# Altium schematic sheet Memory_SRAM.SchDoc
size A4; SheetNumber: 2; SheetTotal: 7
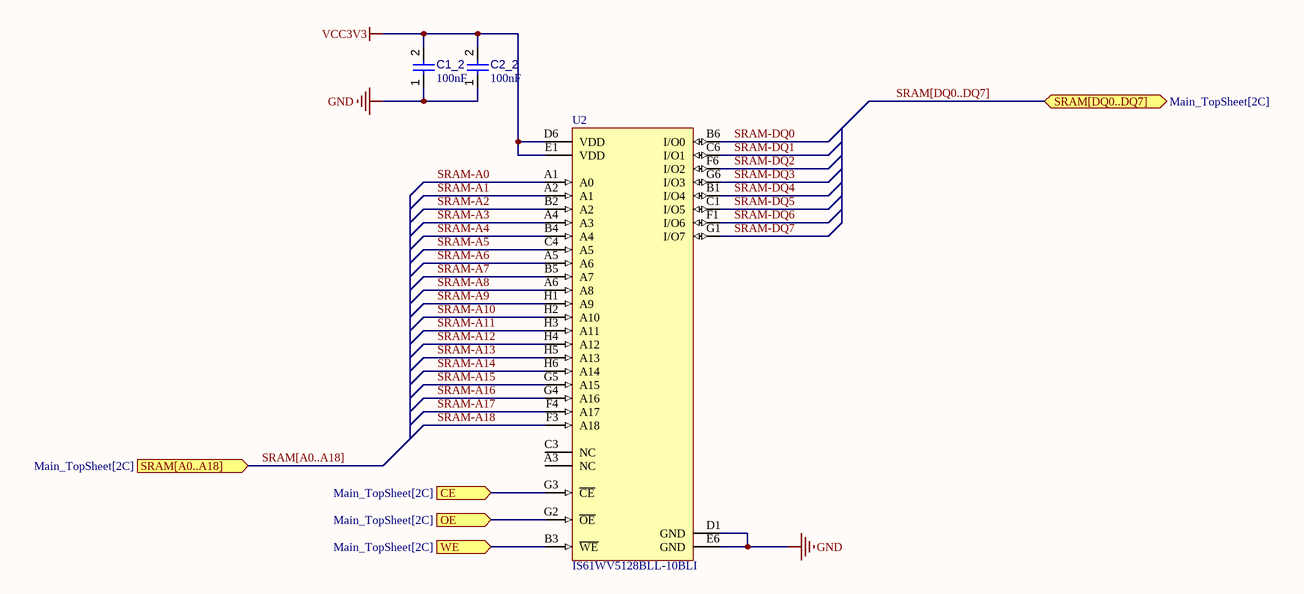
[diagram p0: Memory_SRAM.SchDoc]

## Parts
C1_2  value 100nF  [CAPC0402(1005)60_L]  (hidden comment: Capacitor 100nF +/-20% 10V 0402)
C2_2  value 100nF  [CAPC0402(1005)60_L]  (hidden comment: Capacitor 100nF +/-20% 10V 0402)
U2  IS61WV5128BLL-10BLI  [FP-IS61WV5128BLL-10BLI-IPC_A]

## Ports
CE (in, see Main_TopSheet[2C]), OE (in, see Main_TopSheet[2C]), SRAM[A0..A18] (in, see Main_TopSheet[2C]), SRAM[DQ0..DQ7] (bidir, see Main_TopSheet[2C]), WE (in, see Main_TopSheet[2C])

## Nets
GND: C1_2.1 C2_2.1 U2.D1(GND) U2.E6(GND)
VCC3V3: C1_2.2 C2_2.2 U2.D6(VDD) U2.E1(VDD)
CE: U2.G3(~{CE}) ; port CE
OE: U2.G2(~{OE}) ; port OE
SRAM-A0: U2.A1(A0)
SRAM-A1: U2.A2(A1)
SRAM-A2: U2.B2(A2)
SRAM-A3: U2.A4(A3)
SRAM-A4: U2.B4(A4)
SRAM-A5: U2.C4(A5)
SRAM-A6: U2.A5(A6)
SRAM-A7: U2.B5(A7)
SRAM-A8: U2.A6(A8)
SRAM-A9: U2.H1(A9)
SRAM-A10: U2.H2(A10)
SRAM-A11: U2.H3(A11)
SRAM-A12: U2.H4(A12)
SRAM-A13: U2.H5(A13)
SRAM-A14: U2.H6(A14)
SRAM-A15: U2.G5(A15)
SRAM-A16: U2.G4(A16)
SRAM-A17: U2.F4(A17)
SRAM-A18: U2.F3(A18)
SRAM-DQ0: U2.B6(I/O0)
SRAM-DQ1: U2.C6(I/O1)
SRAM-DQ2: U2.F6(I/O2)
SRAM-DQ3: U2.G6(I/O3)
SRAM-DQ4: U2.B1(I/O4)
SRAM-DQ5: U2.C1(I/O5)
SRAM-DQ6: U2.F1(I/O6)
SRAM-DQ7: U2.G1(I/O7)
WE: U2.B3(~{WE}) ; port WE

Not connected (* = marked no-connect by the designer): U2 A3(NC) C3(NC)

## Buses and harness runs
bus SRAM[A0..A18] = port SRAM[A0..A18]
bus SRAM[DQ0..DQ7] = port SRAM[DQ0..DQ7]

## Library data of the parts
C1_2 C2_2 = CMP-001-00061-3: Chip Capacitor, 100nF +/-20%, 10V, 0402, Thickness 0.6 mm; Tolerance: 20%; Mounting Technology: SMT; Voltage Rating: 10V; Max Operating Temperature: 85°C; Pins: 2; Case/Package: 0402; Min Operating Temperature: -55°C
U2 = CMP-0513-00068-2: NexarPartId: 11886108; Density: 4Mb; Min Supply Voltage: 2.4V; Memory Type: SRAM; Number of Words: 512000; Nominal Supply Current: 40mA; Access Time: 10ns; Interface: Parallel; Memory Size: 512kB; Number of Ports: 1; Word Size: 8b; Sync/Async: Asynchronous; Address Bus Width: 19b; Max Supply Voltage: 3.6V; Number of Pins: 36; RoHS: Compliant; Min Operating Temperature: -40°C; Height: 1.2mm; Case/Package: BGA; Max Operating Temperature: 85°C; Ambient Temperature Range High: 85°C; Schedule B: 8542320040, 8542320040; Radiation Hardening: No